# Altium schematic sheet PowerBoard.SchDoc: DriveHUB CardFrame - Backplane Power
size A3; Date: 01/08/22; Engineer: AJC; DocumentNumber: 35-735; Revision: D; SheetNumber: 1; SheetTotal: 3; Manager: AJC
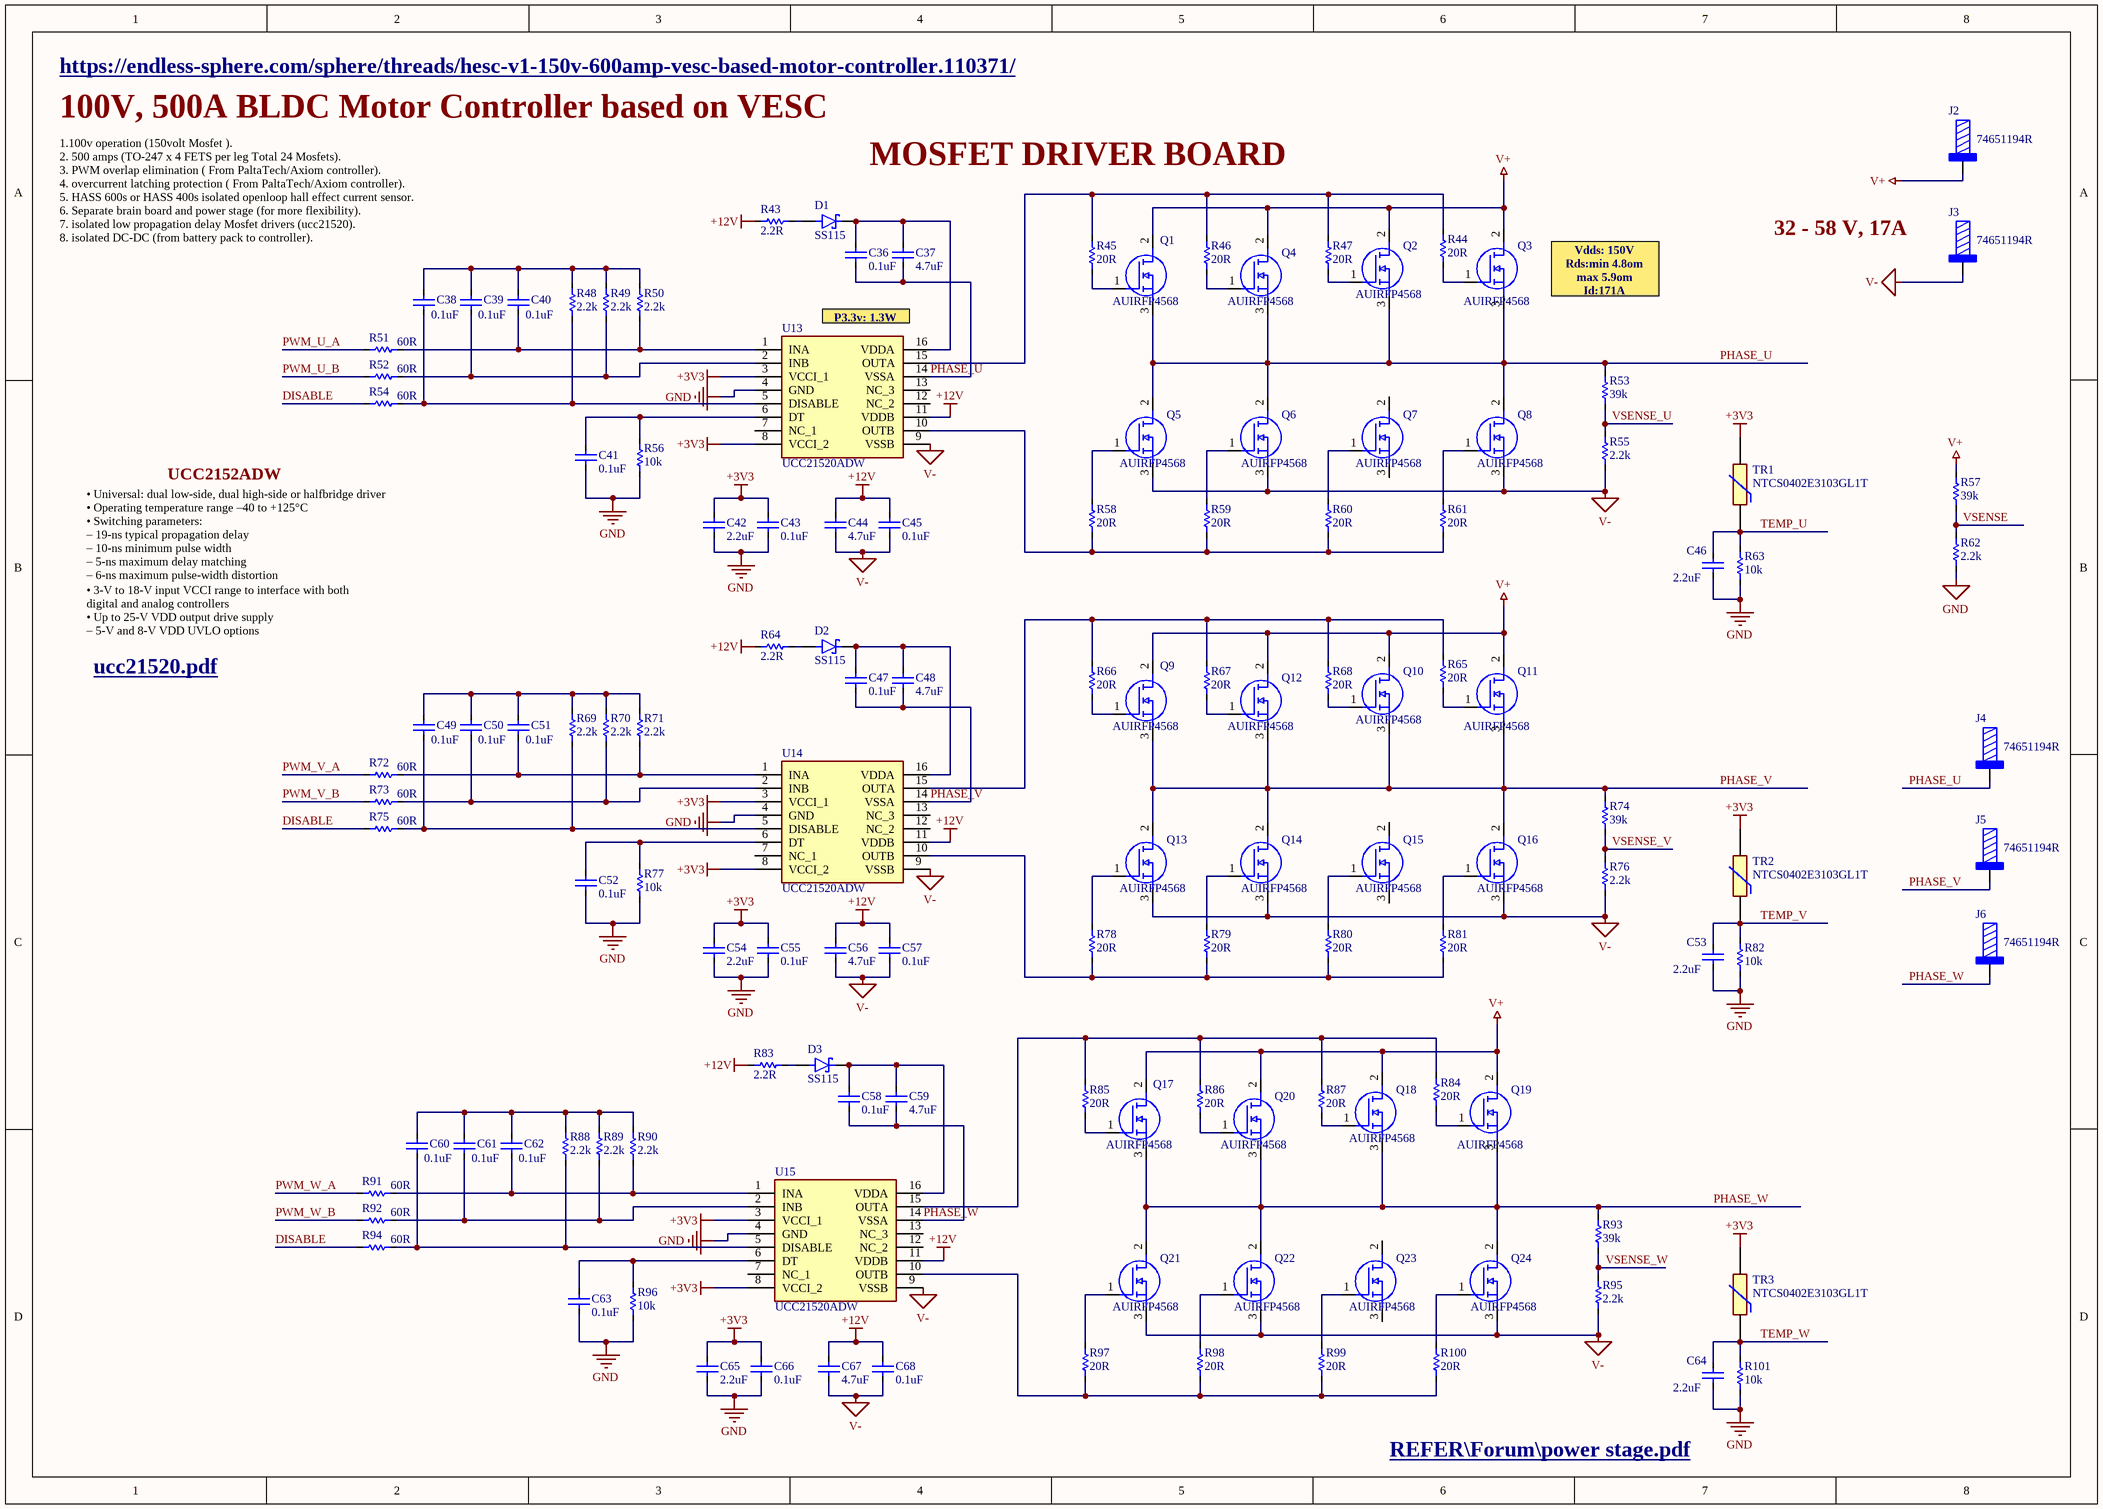
[diagram p0: PowerBoard.SchDoc]

## Parts
C36  0.1uF  [SMD_C(0402)]
C37  4.7uF  [SMD_C(0603)]
C38  0.1uF  [SMD_C(0402)]
C39  0.1uF  [SMD_C(0402)]
C40  0.1uF  [SMD_C(0402)]
C41  0.1uF  [SMD_C(0402)]
C42  2.2uF  [SMD_C(0603)]
C43  0.1uF  [SMD_C(0402)]
C44  4.7uF  [SMD_C(0603)]
C45  0.1uF  [SMD_C(0402)]
C46  2.2uF  [SMD_C(0402)]
C47  0.1uF  [SMD_C(0402)]
C48  4.7uF  [SMD_C(0603)]
C49  0.1uF  [SMD_C(0402)]
C50  0.1uF  [SMD_C(0402)]
C51  0.1uF  [SMD_C(0402)]
C52  0.1uF  [SMD_C(0402)]
C53  2.2uF  [SMD_C(0402)]
C54  2.2uF  [SMD_C(0603)]
C55  0.1uF  [SMD_C(0402)]
C56  4.7uF  [SMD_C(0603)]
C57  0.1uF  [SMD_C(0402)]
C58  0.1uF  [SMD_C(0402)]
C59  4.7uF  [SMD_C(0603)]
C60  0.1uF  [SMD_C(0402)]
C61  0.1uF  [SMD_C(0402)]
C62  0.1uF  [SMD_C(0402)]
C63  0.1uF  [SMD_C(0402)]
C64  2.2uF  [SMD_C(0402)]
C65  2.2uF  [SMD_C(0603)]
C66  0.1uF  [SMD_C(0402)]
C67  4.7uF  [SMD_C(0603)]
C68  0.1uF  [SMD_C(0402)]
D1  SS115  [DIOM4325X250N]
D2  SS115  [DIOM4325X250N]
D3  SS115  [DIOM4325X250N]
J2  74651194R  [74651194]
J3  74651194R  [74651194]
J4  74651194R  [74651194]
J5  74651194R  [74651194]
J6  74651194R  [74651194]
Q1  AUIRFP4568  [TO546P531X1558X2499-3P]
Q2  AUIRFP4568  [TO546P531X1558X2499-3P]
Q3  AUIRFP4568  [TO546P531X1558X2499-3P]
Q4  AUIRFP4568  [TO546P531X1558X2499-3P]
Q5  AUIRFP4568  [TO546P531X1558X2499-3P]
Q6  AUIRFP4568  [TO546P531X1558X2499-3P]
Q7  AUIRFP4568  [TO546P531X1558X2499-3P]
Q8  AUIRFP4568  [TO546P531X1558X2499-3P]
Q9  AUIRFP4568  [TO546P531X1558X2499-3P]
Q10  AUIRFP4568  [TO546P531X1558X2499-3P]
Q11  AUIRFP4568  [TO546P531X1558X2499-3P]
Q12  AUIRFP4568  [TO546P531X1558X2499-3P]
Q13  AUIRFP4568  [TO546P531X1558X2499-3P]
Q14  AUIRFP4568  [TO546P531X1558X2499-3P]
Q15  AUIRFP4568  [TO546P531X1558X2499-3P]
Q16  AUIRFP4568  [TO546P531X1558X2499-3P]
Q17  AUIRFP4568  [TO546P531X1558X2499-3P]
Q18  AUIRFP4568  [TO546P531X1558X2499-3P]
Q19  AUIRFP4568  [TO546P531X1558X2499-3P]
Q20  AUIRFP4568  [TO546P531X1558X2499-3P]
Q21  AUIRFP4568  [TO546P531X1558X2499-3P]
Q22  AUIRFP4568  [TO546P531X1558X2499-3P]
Q23  AUIRFP4568  [TO546P531X1558X2499-3P]
Q24  AUIRFP4568  [TO546P531X1558X2499-3P]
R43  2.2R  [SMD_R(0402)]
R44  20R  [SMD_R(0402)]
R45  20R  [SMD_R(0402)]
R46  20R  [SMD_R(0402)]
R47  20R  [SMD_R(0402)]
R48  2.2k  [SMD_R(0402)]
R49  2.2k  [SMD_R(0402)]
R50  2.2k  [SMD_R(0402)]
R51  60R  [SMD_R(0402)]
R52  60R  [SMD_R(0402)]
R53  39k  [SMD_R(0402)]
R54  60R  [SMD_R(0402)]
R55  2.2k  [SMD_R(0402)]
R56  10k  [SMD_R(0402)]
R57  39k  [SMD_R(0402)]
R58  20R  [SMD_R(0402)]
R59  20R  [SMD_R(0402)]
R60  20R  [SMD_R(0402)]
R61  20R  [SMD_R(0402)]
R62  2.2k  [SMD_R(0402)]
R63  10k  [SMD_R(0402)]
R64  2.2R  [SMD_R(0402)]
R65  20R  [SMD_R(0402)]
R66  20R  [SMD_R(0402)]
R67  20R  [SMD_R(0402)]
R68  20R  [SMD_R(0402)]
R69  2.2k  [SMD_R(0402)]
R70  2.2k  [SMD_R(0402)]
R71  2.2k  [SMD_R(0402)]
R72  60R  [SMD_R(0402)]
R73  60R  [SMD_R(0402)]
R74  39k  [SMD_R(0402)]
R75  60R  [SMD_R(0402)]
R76  2.2k  [SMD_R(0402)]
R77  10k  [SMD_R(0402)]
R78  20R  [SMD_R(0402)]
R79  20R  [SMD_R(0402)]
R80  20R  [SMD_R(0402)]
R81  20R  [SMD_R(0402)]
R82  10k  [SMD_R(0402)]
R83  2.2R  [SMD_R(0402)]
R84  20R  [SMD_R(0402)]
R85  20R  [SMD_R(0402)]
R86  20R  [SMD_R(0402)]
R87  20R  [SMD_R(0402)]
R88  2.2k  [SMD_R(0402)]
R89  2.2k  [SMD_R(0402)]
R90  2.2k  [SMD_R(0402)]
R91  60R  [SMD_R(0402)]
R92  60R  [SMD_R(0402)]
R93  39k  [SMD_R(0402)]
R94  60R  [SMD_R(0402)]
R95  2.2k  [SMD_R(0402)]
R96  10k  [SMD_R(0402)]
R97  20R  [SMD_R(0402)]
R98  20R  [SMD_R(0402)]
R99  20R  [SMD_R(0402)]
R100  20R  [SMD_R(0402)]
R101  10k  [SMD_R(0402)]
TR1  NTCS0402E3103GL1T  [THRMC1005X65N]
TR2  NTCS0402E3103GL1T  [THRMC1005X65N]
TR3  NTCS0402E3103GL1T  [THRMC1005X65N]
U13  UCC21520ADW  [SOIC127P1030X265-16N]
U14  UCC21520ADW  [SOIC127P1030X265-16N]
U15  UCC21520ADW  [SOIC127P1030X265-16N]

## Nets
+3V3: C42.2 C43.2 C54.2 C55.2 C65.2 C66.2 TR1.2 TR2.2 TR3.2 U13.3(VCCI_1) U13.8(VCCI_2) U14.3(VCCI_1) U14.8(VCCI_2) U15.3(VCCI_1) U15.8(VCCI_2)
+12V: C44.2 C45.2 C56.2 C57.2 C67.2 C68.2 R43.1 R64.1 R83.1 U13.11(VDDB) U14.11(VDDB) U15.11(VDDB)
GND: C41.1 C42.1 C43.1 C46.1 C52.1 C53.1 C54.1 C55.1 C63.1 C64.1 C65.1 C66.1 R56.1 R62.1 R63.1 R77.1 R82.1 R96.1 R101.1 U13.4(GND) U14.4(GND) U15.4(GND)
V+: J2.1 Q1.2(D) Q2.2(D) Q3.2(D) Q4.2(D) Q9.2(D) Q10.2(D) Q11.2(D) Q12.2(D) Q17.2(D) Q18.2(D) Q19.2(D) Q20.2(D) R57.2
V-: C44.1 C45.1 C56.1 C57.1 C67.1 C68.1 J3.1 Q5.3(S) Q6.3(S) Q8.3(S) Q13.3(S) Q14.3(S) Q16.3(S) Q21.3(S) Q22.3(S) Q24.3(S) R55.1 R76.1 R95.1 U13.9(VSSB) U14.9(VSSB) U15.9(VSSB)
DISABLE: R54.1 R75.1 R94.1
PHASE_U: C36.1 C37.1 J4.1 Q1.3(S) Q2.3(S) Q3.3(S) Q4.3(S) Q5.2(D) Q6.2(D) Q8.2(D) R53.2 U13.14(VSSA)
PHASE_V: C47.1 C48.1 J5.1 Q9.3(S) Q10.3(S) Q11.3(S) Q12.3(S) Q13.2(D) Q14.2(D) Q16.2(D) R74.2 U14.14(VSSA)
PHASE_W: C58.1 C59.1 J6.1 Q17.3(S) Q18.3(S) Q19.3(S) Q20.3(S) Q21.2(D) Q22.2(D) Q24.2(D) R93.2 U15.14(VSSA)
PWM_U_A: R51.1
PWM_U_B: R52.1
PWM_V_A: R72.1
PWM_V_B: R73.1
PWM_W_A: R91.1
PWM_W_B: R92.1
TEMP_U: C46.2 R63.2 TR1.1
TEMP_V: C53.2 R82.2 TR2.1
TEMP_W: C64.2 R101.2 TR3.1
VSENSE: R57.1 R62.2
VSENSE_U: R53.1 R55.2
VSENSE_V: R74.1 R76.2
VSENSE_W: R93.1 R95.2
NetC36_2: C36.2 C37.2 D1.C(K) U13.16(VDDA)
NetC38_1: C38.1 R48.1 R54.2 U13.5(DISABLE)
NetC38_2: C38.2 C39.2 C40.2 R48.2 R49.2 R50.2
NetC39_1: C39.1 R49.1 R52.2 U13.2(INB)
NetC40_1: C40.1 R50.1 R51.2 U13.1(INA)
NetC41_2: C41.2 R56.2 U13.6(DT)
NetC47_2: C47.2 C48.2 D2.C(K) U14.16(VDDA)
NetC49_1: C49.1 R69.1 R75.2 U14.5(DISABLE)
NetC49_2: C49.2 C50.2 C51.2 R69.2 R70.2 R71.2
NetC50_1: C50.1 R70.1 R73.2 U14.2(INB)
NetC51_1: C51.1 R71.1 R72.2 U14.1(INA)
NetC52_2: C52.2 R77.2 U14.6(DT)
NetC58_2: C58.2 C59.2 D3.C(K) U15.16(VDDA)
NetC60_1: C60.1 R88.1 R94.2 U15.5(DISABLE)
NetC60_2: C60.2 C61.2 C62.2 R88.2 R89.2 R90.2
NetC61_1: C61.1 R89.1 R92.2 U15.2(INB)
NetC62_1: C62.1 R90.1 R91.2 U15.1(INA)
NetC63_2: C63.2 R96.2 U15.6(DT)
NetD1_A: D1.A R43.2
NetD2_A: D2.A R64.2
NetD3_A: D3.A R83.2
NetQ1_1: Q1.1(G) R45.1
NetQ2_1: Q2.1(G) R47.1
NetQ3_1: Q3.1(G) R44.1
NetQ4_1: Q4.1(G) R46.1
NetQ5_1: Q5.1(G) R58.2
NetQ6_1: Q6.1(G) R59.2
NetQ7_1: Q7.1(G) R60.2
NetQ8_1: Q8.1(G) R61.2
NetQ9_1: Q9.1(G) R66.1
NetQ10_1: Q10.1(G) R68.1
NetQ11_1: Q11.1(G) R65.1
NetQ12_1: Q12.1(G) R67.1
NetQ13_1: Q13.1(G) R78.2
NetQ14_1: Q14.1(G) R79.2
NetQ15_1: Q15.1(G) R80.2
NetQ16_1: Q16.1(G) R81.2
NetQ17_1: Q17.1(G) R85.1
NetQ18_1: Q18.1(G) R87.1
NetQ19_1: Q19.1(G) R84.1
NetQ20_1: Q20.1(G) R86.1
NetQ21_1: Q21.1(G) R97.2
NetQ22_1: Q22.1(G) R98.2
NetQ23_1: Q23.1(G) R99.2
NetQ24_1: Q24.1(G) R100.2
NetR44_2: R44.2 R45.2 R46.2 R47.2 U13.15(OUTA)
NetR58_1: R58.1 R59.1 R60.1 R61.1 U13.10(OUTB)
NetR65_2: R65.2 R66.2 R67.2 R68.2 U14.15(OUTA)
NetR78_1: R78.1 R79.1 R80.1 R81.1 U14.10(OUTB)
NetR84_2: R84.2 R85.2 R86.2 R87.2 U15.15(OUTA)
NetR97_1: R97.1 R98.1 R99.1 R100.1 U15.10(OUTB)

Not connected (* = marked no-connect by the designer): Q7 2(D) 3(S); Q15 2(D) 3(S); Q23 2(D) 3(S); U13 7(NC_1) 12(NC_2) 13(NC_3); U14 7(NC_1) 12(NC_2) 13(NC_3); U15 7(NC_1) 12(NC_2) 13(NC_3)

## Notes on the sheet
- https://endless-sphere.com/sphere/threads/hesc-v1-150v-600amp-vesc-based-motor-controller.110371/
- 100V, 500A BLDC Motor Controller based on VESC
- MOSFET DRIVER BOARD
- (near J3) 32 - 58 V, 17A
- 1.100v operation (150volt Mosfet ).
  2. 500 amps (TO-247 x 4 FETS per leg Total 24 Mosfets).
  3. PWM overlap elimination ( From PaltaTech/Axiom controller).
  4. overcurrent latching protection ( From PaltaTech/Axiom controller).
  5. HASS 600s or HASS 400s isolated openloop hall effect current sensor.
  6. Separate brain board and power stage (for more flexibility).
  7. isolated low propagation delay Mosfet drivers (ucc21520).
  8. isolated DC-DC (from battery pack to controller).
- (near U13) P3.3v: 1.3W
- (near Q3) Vdds: 150V
  Rds:min 4.8om
  max 5.9om
  Id:171A
- UCC2152ADW
- • Universal: dual low-side, dual high-side or halfbridge driver
  • Operating temperature range –40 to +125°C
  • Switching parameters:
  – 19-ns typical propagation delay
  – 10-ns minimum pulse width
  – 5-ns maximum delay matching
  – 6-ns maximum pulse-width distortion
- • 3-V to 18-V input VCCI range to interface with both
  digital and analog controllers
  • Up to 25-V VDD output drive supply
  – 5-V and 8-V VDD UVLO options
- ucc21520.pdf <F:\TASK\2023\8\VESC_MotorController\REFER\ucc21520.pdf>
- REFER\Forum\power stage.pdf <F:\TASK\2023\8\VESC_MotorController\REFER\Forum\power stage.pdf>

## Library data of the parts
C36 C38-C41 C43 C45 C47 C49-C52 C55 C57 C58 C60-C63 C66 C68 = Cap_1: Multilayer Ceramic Capacitors MLCC - SMD/SMT 50 V 0.1uF X7R 0603 10%; Manufacturer: Yageo; Manufacturer Part Number: CC0603KPX7R9BB104; Supplier 1: Digi-Key; Supplier Part Number 1: 311-3567-1-ND
C37 C42 C44 C48 C54 C56 C59 C65 C67 = Cap_10: PHE840MA6100MA04R17; Manufacturer: Yageo; Manufacturer Part Number: CC0603KPX7R9BB104; Supplier 1: Digi-Key; Supplier Part Number 1: 311-3567-1-ND
C46 C53 C64 = Cap_1: Multilayer Ceramic Capacitors MLCC - SMD/SMT 50 V 0.1uF X7R 0603 10%
D1-D3 = SS115: 1A, 150V, Schottky Rectifier; MF: Taiwan Semiconductor; Package: DO-214AC-2 Taiwan Semiconductor; Check_prices: https://www.snapeda.com/parts/SS115/Taiwan+Semiconductor/view-part/?ref=eda; Value: *; Price: None; Purchase-URL: https://pricing.snapeda.com/search/part/SS115/?ref=eda; MP: SS115; SnapEDA_Link: https://www.snapeda.com/parts/SS115/Taiwan+Semiconductor/view-part/?ref=snap; Availability: In Stock
J2-J6 = 74651194R: WP-THRSH REDCUBE THR with external thread, M4 x 5mm, 85A; Manufacturer: Wurth Elektronik; Surface: Tin; ComponentLink1Description: Website Link; ComponentLink1URL: https://www.we-online.com/redexpert/article/74651194R?ad; ComponentLink2Description: Datasheet Link; ComponentLink2URL: https://www.we-online.com/redexpert/spec/74651194R?ad; Manufacturer Part Number: 74651194R; Category: REDCUBE THR; Match Code: WP-THRSH; Mount: Through Hole Reflow; Operating Temperature Max: 150°C; Operating Temperature Min: -55°C; Packaging: Tape and Reel; Length: 10mm; Width: 10mm; Height: 8.5mm; Material: Brass; Number of Pins: 9; Rated Current: 85A; Thread Length: 5mm; Thread Size: M4; Supplier: Mouser; Supplier Part Number: 710-74651195R; Price: 3.5; Value: 74651194R
Q1-Q24 = AUIRFP4568: MOSFET N-CHANNEL 100+; Manufacturer_Name: Infineon; Geometry.Height: 5.31mm; Mouser Part Number: 942-AUIRFP4568; Mouser Price/Stock: https://www.mouser.co.uk/ProductDetail/Infineon-IR/AUIRFP4568?qs=m1T3c8F5IUIdoWYie9aRBg%3D%3D; Manufacturer_Part_Number: AUIRFP4568; Datasheet Link: https://www.infineon.com/dgdl/auirfp4568.pdf?fileId=5546d462533600a4015355b1d8751458
R43-R47 R51 R52 R54 R58-R61 R64-R68 R72 R73 R75 R78-R81 R83-R87 R91 R92 R94 R97-R100 = Res Semi_1: CRCW04024R02FKED; Published: 8-Jun-2000; LatestRevisionDate: 17-Jul-2002; LatestRevisionNote: Re-released for DXP Platform.; PackageReference: AXIAL-0.5; Publisher: Altium Limited; PackageDescription: Axial Device, Thru-Hole; 2 Leads; 0.5 in Pin Spacing
R48-R50 R69-R71 R88-R90 = Res Semi_2: CRCW04024R02FKED; Published: 8-Jun-2000; LatestRevisionDate: 17-Jul-2002; LatestRevisionNote: Re-released for DXP Platform.; PackageReference: AXIAL-0.5; Publisher: Altium Limited; PackageDescription: Axial Device, Thru-Hole; 2 Leads; 0.5 in Pin Spacing
R53 R55-R57 R62 R63 R74 R76 R77 R82 R93 R95 R96 R101 = Res Semi_5: CRCW04024R02FKED; Published: 8-Jun-2000; LatestRevisionDate: 17-Jul-2002; LatestRevisionNote: Re-released for DXP Platform.; PackageReference: AXIAL-0.5; Publisher: Altium Limited; PackageDescription: Axial Device, Thru-Hole; 2 Leads; 0.5 in Pin Spacing
TR1-TR3 = NTCS0402E3103GL1T: NTC Thermistors 10Kohms 2% AEC-Q200; Manufacturer_Name: Vishay; Geometry.Height: 0.65mm; Mouser Part Number: 594-NTCS402E3103GL1T; Mouser Price/Stock: https://www.mouser.co.uk/ProductDetail/Vishay-BC-Components/NTCS0402E3103GL1T?qs=u16ybLDytRYI8lwq3wWutw%3D%3D; Manufacturer_Part_Number: NTCS0402E3103GL1T; Datasheet Link: https://www.mouser.in/datasheet/2/427/ntcs0402e3t-1762119.pdf
U13-U15 = UCC21520ADW: 4A/6A, 5.7 kVrms Isolated Dual Channel Gate Driver; Manufacturer_Name: Texas Instruments; Geometry.Height: 2.65mm; Mouser Part Number: 595-UCC21520ADW; Mouser Price/Stock: https://www.mouser.co.uk/ProductDetail/Texas-Instruments/UCC21520ADW?qs=%2FP2Ij7fVdhFsQr%252B%2F6P1laA%3D%3D; Manufacturer_Part_Number: UCC21520ADW; Datasheet Link: http://www.ti.com/lit/gpn/ucc21520